# EAGLE schematic RAUPS_SingleLayer_Heater (EAGLE 7.2.0)
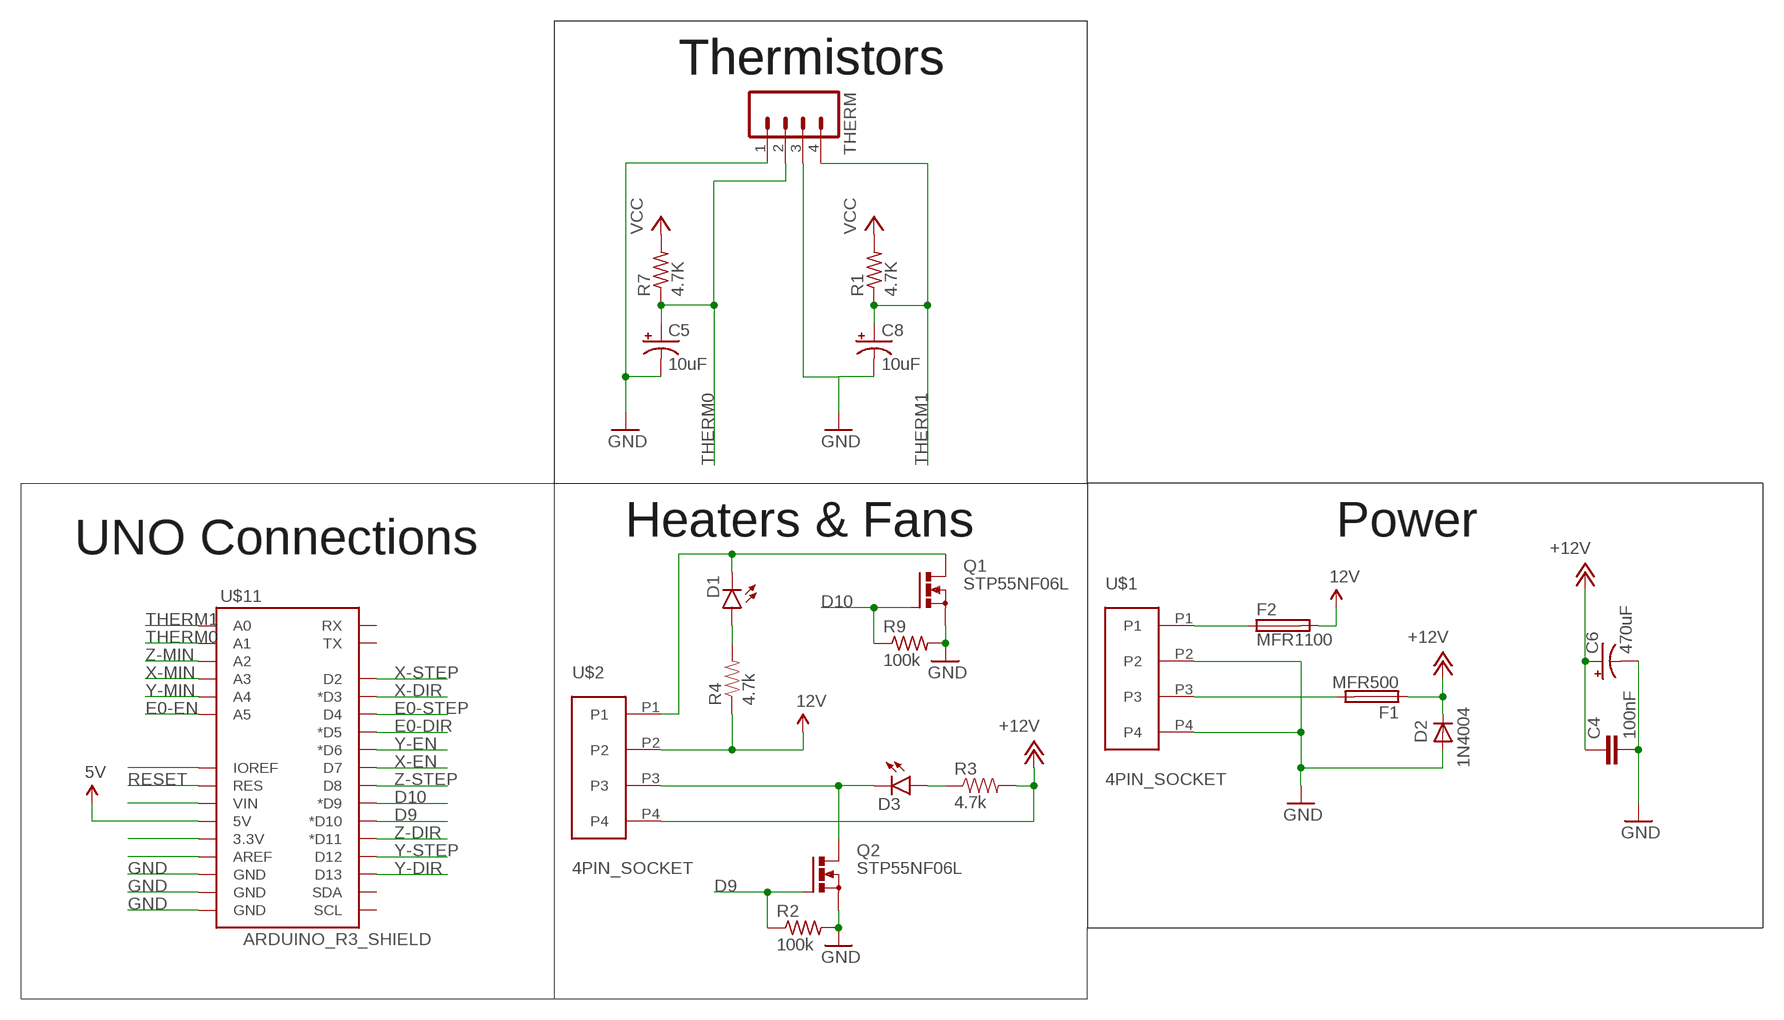
[diagram p0: schematic, sheet 1]

## Parts
C4  100nF  C2,5-3  [C2.5-3]
C5  10uF  CPOL-USE2.5-5  [E2,5-5]
C6  470uF  CPOL-USE3.5-8  [E3,5-8]
C8  10uF  CPOL-USE2.5-5  [E2,5-5]
D1  LED-3MM-NO_SILK  [LED3MM-NS]
D2  1N4004  [DO41-10]
D3  LED-3MM-NO_SILK  [LED3MM-NS]
F1  MFR500  PTCFUSE  [MFR500]
F2  MFR1100  PTCFUSEMFR1100  [MFR1100]
Q1  STP55NF06L  IRF512  [TO220BV]
Q2  STP55NF06L  IRF512  [TO220BV]
R1  4.7K  R-US_0207/7  [0207/7]
R2  100k  R-US_0207/7  [0207/7]
R3  4.7k  1KOHM-1/4W-5%(PTH)  [AXIAL-0.3]
R4  4.7k  1KOHM-1/4W-5%(PTH)  [AXIAL-0.3]
R7  4.7K  R-US_0207/7  [0207/7]
R9  100k  R-US_0207/7  [0207/7]
THERM  M04LONGPADS  [1X04_LONGPADS]
U$1  4PIN_SOCKET  [CONN-4PIN]
U$2  4PIN_SOCKET  [CONN-4PIN]
U$11  ARDUINO_R3_SHIELD  [UNO_R3_SHIELD]

## Nets
5V: U$11.5V
12V: F2.2 R4.P$1 U$2.P2
+12V: C4.1 C6.+ D2.C F1.1 R3.P$2 U$2.P4
D9: Q2.G R2.1 U$11.D10(*D10)
D10: Q1.G R9.1 U$11.D9(*D9)
E0-DIR: U$11.D5(*D5)
E0-EN: U$11.A5
E0-STEP: U$11.D4
GND: C4.2 C5.- C6.- C8.- D2.A Q1.S Q2.S R2.2 R9.2 THERM.1 THERM.3 U$1.P2 U$1.P4 U$11.GND@0(GND) U$11.GND@1(GND) U$11.GND@2(GND)
N$1: D3.K(C) Q2.D U$2.P3
N$2: F2.1 U$1.P1
N$7: D1.K(C) Q1.D U$2.P1
N$12: U$11.IOREF
N$16: U$11.VIN
N$24: U$11.3.3V
N$25: U$11.AREF
N$32: F1.2 U$1.P3
N$34: D1.A R4.P$2
N$35: D3.A R3.P$1
RESET: U$11.RES
THERM0: C5.+ R7.1 THERM.2 U$11.A1
THERM1: C8.+ R1.1 THERM.4 U$11.A0
VCC: R1.2 R7.2
X-DIR: U$11.D3(*D3)
X-EN: U$11.D7
X-MIN: U$11.A3
X-STEP: U$11.D2
Y-DIR: U$11.D13
Y-EN: U$11.D6(*D6)
Y-MIN: U$11.A4
Y-STEP: U$11.D12
Z-DIR: U$11.D11(*D11)
Z-MIN: U$11.A2
Z-STEP: U$11.D8
Unconnected: U$11.RX U$11.SCL U$11.SDA U$11.TX

## Notes on the sheet
- Thermistors | Thermistors
- Heaters & Fans | Power
- UNO Connections

## Library data of the parts
C4 = capacitor-wima:C: CAPACITOR naming: grid - package width
C5 C6 C8 = adafruit:CPOL-US: POLARIZED CAPACITOR, American symbol
D1 D3 = SparkFun-LED:LED: LEDs Standard schematic elements and footprints for 5mm, 3mm, 1206, and 0603 sized LEDs. 5mm - Spark Fun Electronics SKU : COM-00529 (and others)
D2 = diode:1N4004: DIODE general purpose rectifier, 1 A
F1 F2 = RepRapjr:PTCFUSE: LITTLEFUSE Picofuse/slow Littlefuse
Q1 Q2 = transistor-power:IRF512: N-CHANNEL MOS FET
R1 R2 R7 R9 = adafruit:R-US_: RESISTOR, American symbol
R3 R4 = SparkFun-Resistors:1KOHM-1/4W-5%(PTH): RES-08380; PROD_ID: RES-08380; VALE: 1k
THERM = SparkFun-Connectors:M04: Header 4 Standard 4-pin 0.1" header. Use with straight break away headers (SKU : PRT-00116), right angle break away headers (PRT-00553), swiss pins (PRT-00743), machine pins (PRT-00117), and female headers (PRT-00115). Molex polarized connector foot print use with SKU : PRT-08231 with associated crimp pins and housings. 1MM SMD Version SKU: PRT-10208
U$1 U$2 = ControllerCard:4PIN_SOCKET
U$11 = SparkFun-Boards:ARDUINO_R3_SHIELD: Shield form compatible with the Arduino Uno R3.

## Net classes
0 default: width 0.406 mm